# Altium schematic sheet driver_V1.2.SchDoc
size A4
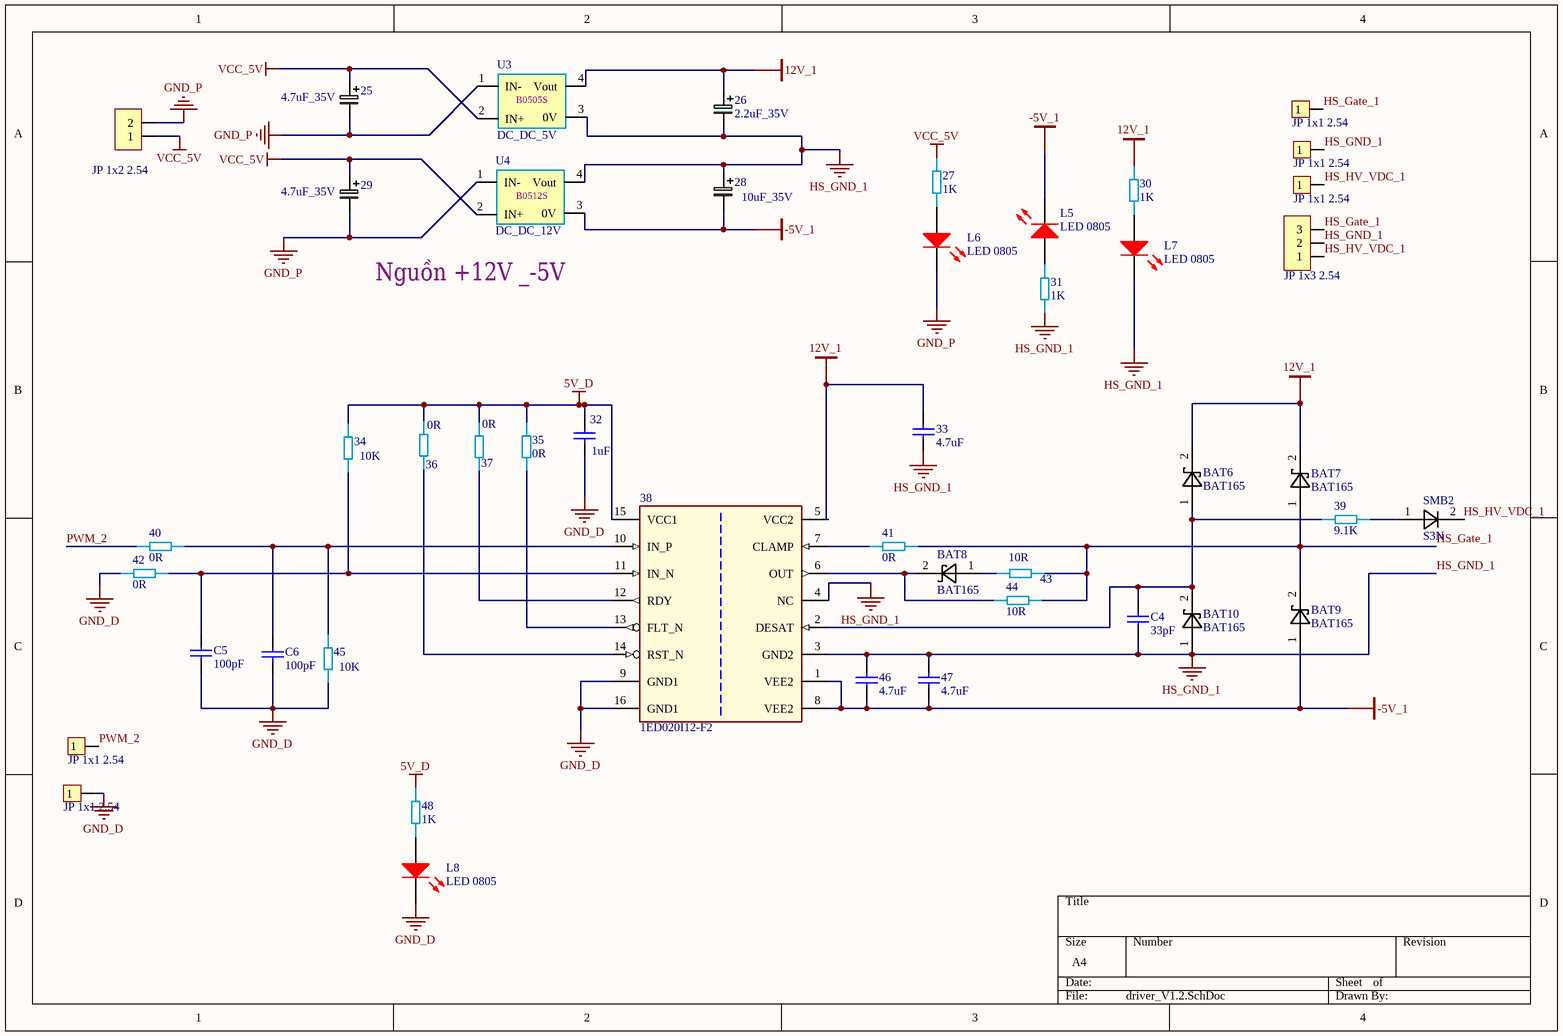
[diagram p0: driver_V1.2.SchDoc]

## Parts
25  4.7uF_35V  [tu_4x5.4mm]
26  2.2uF_35V  [tu_4x5.4mm]
27  1K  [RES1206]
28  10uF_35V  [tu_4x5.4mm]
29  4.7uF_35V  [tu_4x5.4mm]
30  1K  [RES1206]
31  1K  [RES1206]
32  1uF  [Tu 0805_N]
33  4.7uF  [tu 1206_N]
34  10K  [RES1206]
35  0R  [RES1206]
36  0R  [RES1206]
37  0R  [RES1206]
38  1ED020I12-F2  [SOIC127P1028X264-16N-1]
39  9.1K  [RES_2512]
40  0R  [RES1206]
41  0R  [RES_2512]
42  0R  [RES1206]
43  10R  [RES_2512]
44  10R  [RES_2512]
45  10K  [RES1206]
46  4.7uF  [tu 1206_N]
47  4.7uF  [tu 1206_N]
48  1K  [RES1206]
BAT6  BAT165  [SMB]
BAT7  BAT165  [SMB]
BAT8  BAT165  [SMB]
BAT9  BAT165  [SMB]
BAT10  BAT165  [SMB]
C4  33pF  [Tu 0805_N]
C5  100pF  [Tu 0805_N]
C6  100pF  [Tu 0805_N]
JP9  JP 1x1 2.54  [test_point]
JP10  JP 1x2 2.54  [JP 1x2 DT_n]
JP11  JP 1x1 2.54  [test_point]
JP12  JP 1x1 2.54  [test_point]
JP13  JP 1x3 2.54  [XH2.54M-3]
JP14  JP 1x1 2.54  [test_point]
JP15  JP 1x1 2.54  [test_point]
L5  LED 0805  [LED-0805-Red]
L6  LED 0805  [LED-0805-Red]
L7  LED 0805  [LED-0805-Red]
L8  LED 0805  [LED-0805-Red]
SMB2  S3N  [SMB]
U3  DC_DC_5V  [B0505S/D-1W]
U4  DC_DC_12V  [B0512S/D-1W]

## Nets
5V_D: 32.2 34.2 35.1 36.2 37.1 38.15(VCC1) 48.1
12V_1: 26.1 30.1 33.2 38.5(VCC2) BAT6.2 BAT7.2 U3.4(Vout)
-5V_1: 28.2 38.1(VEE2) 38.8(VEE2) 46.1 47.1 BAT9.1 L5.2(K) U4.3(0V)
GND_D: 32.1 38.9(GND1) 38.16(GND1) 42.2 45.1 C5.1 C6.1 JP15.1 L8.2(K)
GND_P: 25.2 29.2 JP10.2 L6.2(K) U3.1(IN-) U4.1(IN-)
HS_GND_1: 26.2 28.1 31.2 33.1 38.3(GND2) 38.4(NC) 46.2 47.2 BAT10.1 C4.1 JP11.1 JP13.2 L7.2(K) U3.3(0V) U4.4(Vout)
VCC_5V: 25.1 27.1 29.1 JP10.1 U3.2(IN+) U4.2(IN+)
HS_Gate_1: 41.2 43.2 44.2 BAT7.1 BAT9.2 JP9.1 JP13.3
HS_HV_VDC_1: JP12.1 JP13.1 SMB2.2
PWM_2: 40.2 JP14.1
Net27_2: 27.2 L6.1(A)
Net30_2: 30.2 L7.1(A)
Net31_1: 31.1 L5.1(A)
Net34_1: 34.1 38.11(IN_N) 42.1 C5.2
Net35_2: 35.2 38.13(FLT_N)
Net36_1: 36.1 38.14(RST_N)
Net37_2: 37.2 38.12(RDY)
Net38_2: 38.2(DESAT) 39.1 BAT6.1 BAT10.2 C4.2
Net38_6: 38.6(OUT) 44.1 BAT8.2
Net38_7: 38.7(CLAMP) 41.1
Net38_10: 38.10(IN_P) 40.1 45.2 C6.2
Net39_2: 39.2 SMB2.1
Net43_1: 43.1 BAT8.1
Net48_2: 48.2 L8.1(A)

## Notes on the sheet
- Nguồn +12V _-5V
- (in symbol DC_DC_5v) B0505S
- (in symbol DC_DC_12v) B0512S

## Library data of the parts
25 26 28 29 = capacitor_electric
27 30 31 34-37 39-45 48 = 311-0.0GRTR-ND
32 C4-C6 = cap_0805
33 46 47 = cap_1210
38 = 1ED020I12-F2: Single IGBT Driver IC; Manufacturer: Infineon Technologies; Manufacturer Order Number: 1ED020I12-F2; PackageReference: PG-DSO-16-15
JP9 JP11 JP12 JP14 JP15 = JP 1x1 2.54 Duc Thang: Cắm; Ten_Linh_Kien: Jump Đơn Đực 2.54MM 1x40P Thẳng 11MM; Don_Vi: Con; Ma_Hang: MH000903; Ghi_Chu: *; Kieu_Chan: *; Chung_Loai: Cắm
JP10 = JP 1x2 2.54 Duc Thang: Cắm; Ten_Linh_Kien: Jump Đơn Đực 2.54MM 1x40P Thẳng 11MM; Don_Vi: Con; Ma_Hang: MH000903; Ghi_Chu: *; Kieu_Chan: *; Chung_Loai: Cắm
JP13 = JP 1x3 2.54 Duc Cong: Cắm; Ten_Linh_Kien: Jump Đơn Đực 2.54MM 1x40P Cong Đứng; Don_Vi: Con; Ma_Hang: MH000904; Ghi_Chu: *; Kieu_Chan: *; Chung_Loai: Cắm
L5-L8 = LED 0805 Do: Dán; Don_Vi: Con; Ma_Hang: MH000897; Ten_Linh_Kien: LED 0805 Màu Đỏ (Red); Ghi_Chu: *; Kieu_Chan: *; Chung_Loai: Dán
SMB2 = S3A-S3N